# Altium schematic sheet RTC_ds1307z.SchDoc
size A4; DocumentNumber: 9; SheetNumber: 9; SheetTotal: 11
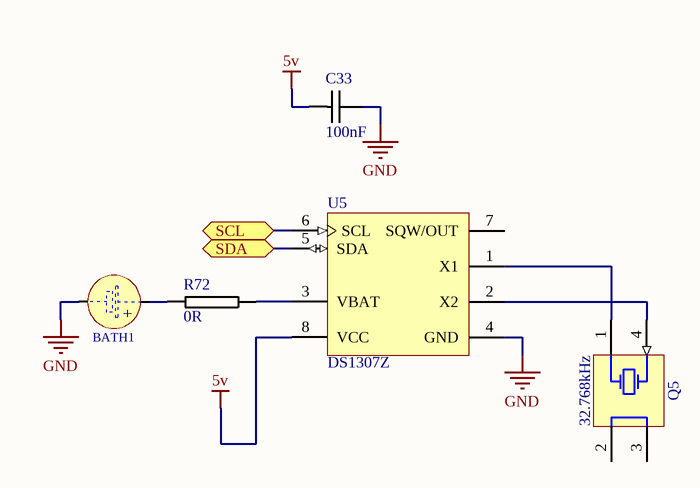
[diagram p0: RTC_ds1307z.SchDoc]

## Parts
BATH1  (no value)  [BATH_KEYSTONE_103]
C33  100nF  [0805C-TBD]
Q5  32.768kHz  [XTAL_EPSON_MC-406]
R72  0R  [0805R-GENERIC]
U5  DS1307Z  [S8-2_N]

## Ports
SCL, SDA

## Nets
5v: C33.1 U5.8(VCC)
GND: BATH1.2(MINUS) C33.2 U5.4(GND)
SCL: U5.6(SCL) ; port SCL
SDA: U5.5(SDA) ; port SDA
NetBATH1_1: BATH1.1(PLUS) R72.1
NetQ5_1: Q5.1(X) U5.1(X1)
NetQ5_4: Q5.4(X) U5.2(X2)
NetR72_2: R72.2 U5.3(VBAT)

Not connected (* = marked no-connect by the designer): Q5 2(GND) 3(GND); U5 7(SQW/OUT)

## Notes on the sheet
- (in symbol BATH_KEYSTONE_103) +

## Library data of the parts
BATH1 = BATH_KEYSTONE_103: Battery Holder whit 2 Pin; Part Description: Battery Holders for 20mm Lithium Coin Cells; Manufacturer Part Number: 103; Table: Batteries; Part Number: BATH_KEYSTONE_103; Component Kind: Standard; Component Type: Standard; Pin Count: 2; PackageDescription: Battery Holders for 20mm Lithium Coin Cells; Family: Battery; Mounted: Yes; Socket: No; SMD: No; Manufacturer: KEYSTONE; ComponentHeight: 8.5mm; HelpURL: \\cern.ch\dfs\Applications\Altium\Datasheets\BATH_KEYSTONE_103.pdf; Author: CERN DEM JLC; CreateDate: 20/10/2009; LatestRevisionDate: 20/10/2009
C33 = 0805C-100nF-25V-X7R-MUR: CAPACITOR 0805 CERAMIC; Supplier 1: Digi-Key; Supplier Part Number 1: 490-1673-1-ND
Q5 = XTAL_32.768KHZ_EPSON_MC-406 32.768K-A3:ROHS: Crystal 4 pins 1=XTAL Control 2 And 3=NC 4=XTAL; Part Description: Load capacitance 12.5pF, Frequency Tolerance ±20 ppm, 40°C to 85°C, Surface Mount Quartz Crystal, MC-406 Serie; Manufacturer: EPSON TOYOCOM; Table: Crystals & Oscillators; Part Number: XTAL_32.768KHZ_EPSON_MC-406 32.768K-A3:ROHS; Component Kind: Standard; Component Type: Standard; PackageDescription: EPSON Crystal; 10.41mm L X 4.06mm W X 3.6mm H; Value: 32.768kHz; Manufacturer Part Number: MC-406 32.768K-A3:ROHS; Pin Count: 4; Mounted: Yes; Socket: No; SMD: Yes; ComponentHeight: 3.6mm; HelpURL: \\cern.ch\dfs\Applications\Altium\Datasheets\XTAL_EPSON_MC-406.pdf; Author: CERN DEM JLC; CreateDate: 27/03/2012; LatestRevisionDate: 30/01/2013
R72 = 0805R-0R: RESISTOR 0805 1 WATT
U5 = DS1307Z: 64 x 8, Serial, I2C Real-Time Clock, 5.0V, 8-Pin SO, 0 to 70 degC; DatasheetVersion: 10-Feb-2008; PackageVersion: revC, 2010; PackageReference: S8-2; PackageDescription: 8-Pin Small-Outline IC, Narrow (0.15in), 1.27 mm Pitch, SOIC (N); Code_JEDEC: MS-012-AA; Code_IPC: SOIC127P600-8; ComponentLink1Description: Manufacturer URL; ComponentLink1URL: http://www.maxim-ic.com; ComponentLink2Description: Datasheet; ComponentLink2URL: http://datasheets.maxim-ic.com/en/ds/DS1307.pdf; ComponentLink3Description: Package Specification; ComponentLink3URL: http://pdfserv.maxim-ic.com/package_dwgs/21-0041.PDF